# EAGLE design DEMO Bus Panel (EAGLE 8.5.0)
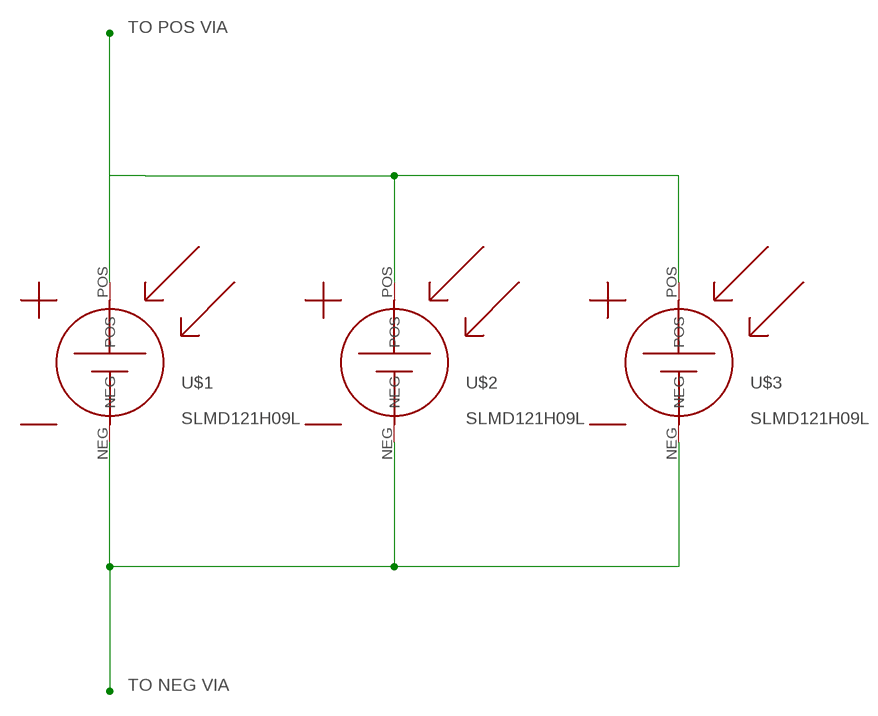
[diagram p0: schematic, sheet 1]

## Parts
U$1  SLMD121H09L  [MONO_SOLAR_CELL_62X21]
U$2  SLMD121H09L  [MONO_SOLAR_CELL_62X21]
U$3  SLMD121H09L  [MONO_SOLAR_CELL_62X21]

## Nets
NEG: U$1.NEG U$2.NEG U$3.NEG
POS: U$1.POS U$2.POS U$3.POS

## Notes on the sheet
- TO POS VIA
- TO NEG VIA

## Library data of the parts
U$1-U$3 = Parts:SLMD121H09L

## Board
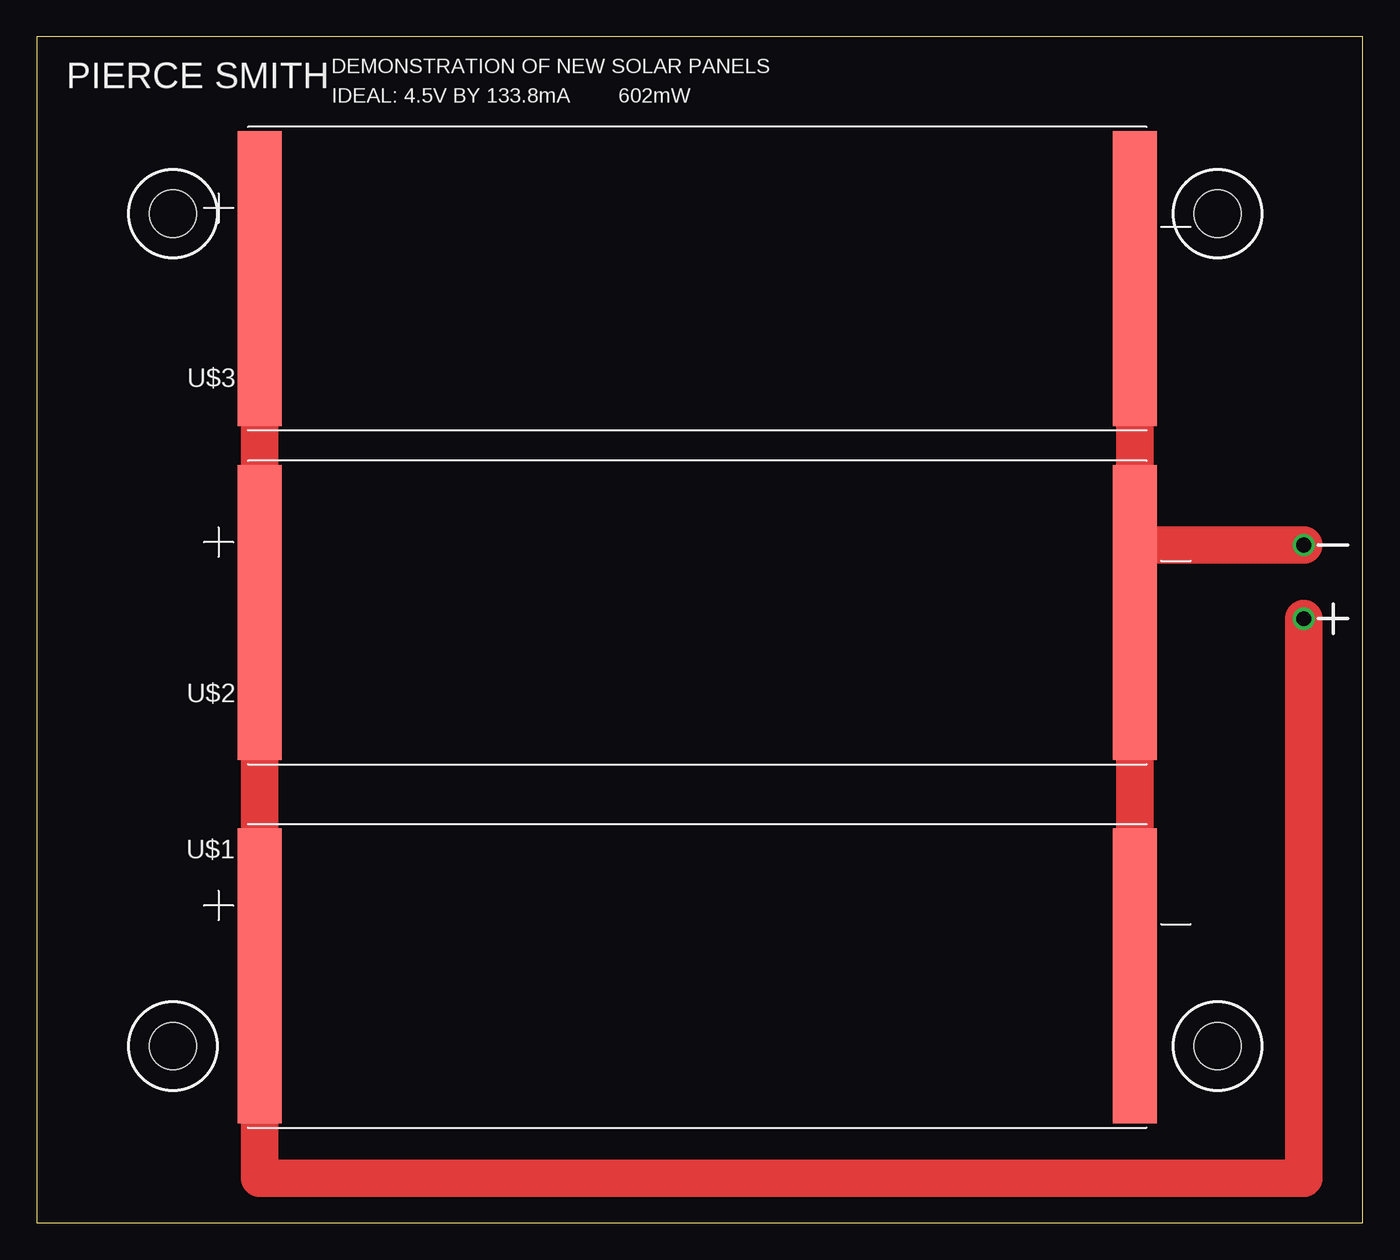
[diagram p1: board, top side]
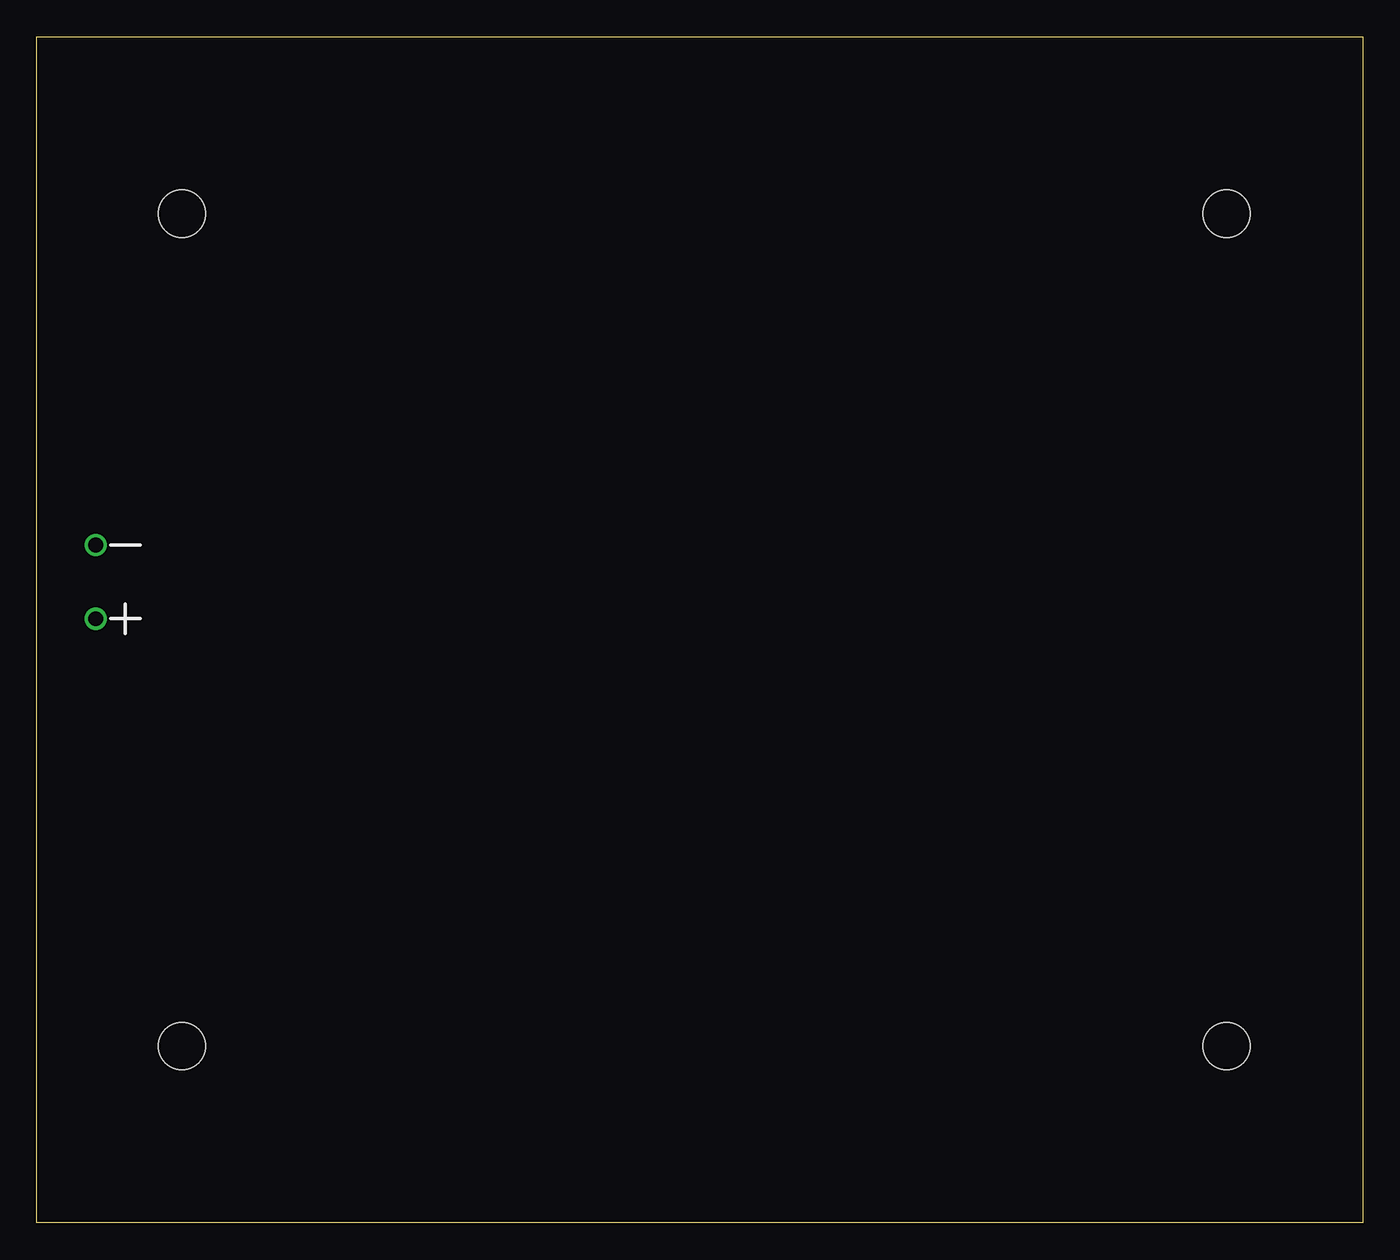
[diagram p2: board, bottom side, seen from below]

Size 90 x 80.5 mm. Coordinates in mm from the lower left corner, seen from the top.
Outline: 0,0 90,0 90,80.5 0,80.5 0,0
Copper layers (1*16): Top 0.035mm / dielectric 1.5mm / Bottom 0.035mm
Design rules "default": minimum track width 6mil, minimum drill 0.35mm, track to track 6mil, track to pad 6mil, pad to pad 6mil, via to via 6mil, smd to smd 6mil, copper to edge 40mil, drill to drill 6mil, minimum pad ring 10mil, minimum via ring 8mil, stop-mask expansion 4mil, vias tented up to drill 0mil, thermal gap 10mil
Holes 3.2 mm at 9.25,12 9.25,68.5 80.15,68.5 80.15,12

### Footprints (pad centres in the part's own frame; a part is rotated, then mirrored left to right if it is on the bottom)
MONO_SOLAR_CELL_62X21 = smd 3 x 20: NEG 60.2,10.3; POS 0.8,10.3

### Placement (x,y rotation side)
U$1  14.33,6.45 0 top
U$2  14.33,31.12 0 top
U$3  14.33,53.79 0 top

### Tracks (layer width: path | path; a pad name or v marks a point on that pad's centre or on a via)
NEG  (via drill 1)
  Top 2.54: U$3.NEG 74.53,46 | 74.53,46 U$2.NEG U$1.NEG | v86,46 74.53,46
POS  (via drill 1)
  Top 2.54: U$3.POS U$2.POS | U$2.POS U$1.POS 15.13,3 86,3 v86,41 | 15.13,41 U$2.POS

### Text on the board
tPlace: DEMONSTRATION OF NEW SOLAR PANELS | PIERCE SMITH | IDEAL: 4.5V BY 133.8mA 602mW